# Altium schematic sheet MCU_ZIGBEE.SchDoc: Y1701
size A3; Date: 2018.11.13; Author: Xianrui; CompanyName: 成都捷祥医疗器械有限公司; Revision: V1.0; SheetNumber: 3; SheetTotal: 6; Time: 20181113
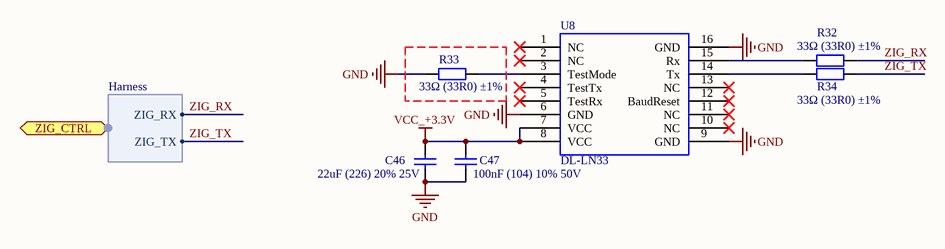
[diagram p0: MCU_ZIGBEE.SchDoc]

## Parts
C46  22uF (226) 20% 25V  [LC-0805_C]
C47  100nF (104) 10% 50V  [LC-0603_C]
R32  33Ω (33R0) ±1%  [LC-0603_R]
R33  33Ω (33R0) ±1%  [LC-0603_R]
R34  33Ω (33R0) ±1%  [LC-0603_R]
U8  DL-LN33  [RCM-DL-LN33]

## Ports
ZIG_CTRL (harness Harness)

## Harnesses
Harness: ZIG_RX, ZIG_TX

## Nets
GND: C46.1 C47.1 R33.1 U8.6(GND) U8.9(GND) U8.16(GND)
VCC_+3.3V: C46.2 C47.2 U8.7(VCC) U8.8(VCC)
ZIG_RX: R32.2 ; port ZIG_CTRL.ZIG_RX
ZIG_TX: R34.2 ; port ZIG_CTRL.ZIG_TX
NetR32_1: R32.1 U8.15(Rx)
NetR33_2: R33.2 U8.3(TestMode)
NetR34_1: R34.1 U8.14(Tx)

Not connected (* = marked no-connect by the designer): U8 1(NC)* 2(NC)* 4(TestTx)* 5(TestRx)* 10(NC)* 11(NC)* 12(BaudReset)* 13(NC)*

## Notes on the sheet
- 项目
- 时间
- 版本/修订
- 编制
- 第
- 审核
- 张
- 共
- 备注

## Library data of the parts
C46 = 0805 22uF (226) 20% 25V: 贴片电容; ComponentLink1Description: 供应商链接; ComponentLink1URL: http://www.szlcsc.com/product/details_46786.html; Package: 0805; Supplier: LC; SuppliersPartNumber: C45783
C47 = 0603 100nF (104) 10% 50V: 贴片电容; ComponentLink1Description: 供应商链接; ComponentLink1URL: http://www.szlcsc.com/product/details_15331.html; Package: 0603; Supplier: LC; SuppliersPartNumber: C14663
R32-R34 = 0603 33Ω (33R0) 1%: 贴片电阻; ComponentLink1Description: 供应商链接; ComponentLink1URL: http://www.szlcsc.com/product/details_23867.html; Package: 0603; Supplier: LC; SuppliersPartNumber: C23140
U8 = DL-LN3X: Zigbee 2.4G Multi-hop AdHos WSN Modules; Manufacture: 深联创新; Comments: DL-LN33; Libnum: *; Ordering: DL-LN33